# Altium schematic sheet DownLoad.SchDoc
size A4
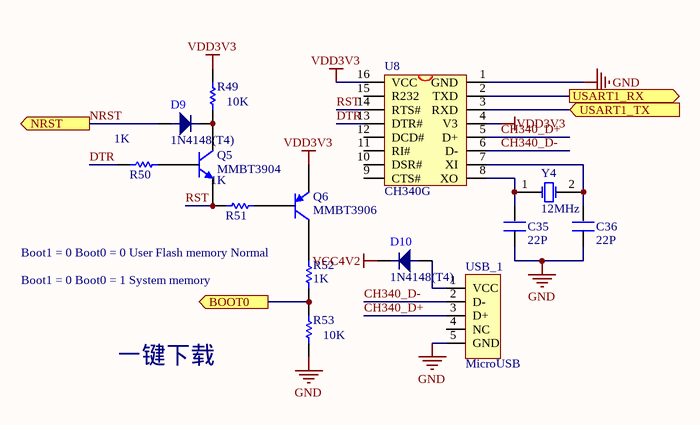
[diagram p0: DownLoad.SchDoc]

## Parts
C35  22P  [0805-CAP]
C36  22P  [0805-CAP]
D9  1N4148(T4)  [SOD-123]
D10  1N4148(T4)  [SOD-123]
Q5  MMBT3904  [SOT23_N]
Q6  MMBT3906  [SOT23_N]
R49  value 10K  [RESC0805(2012)_M]  (hidden comment: 10K 1% 0805(2012))
R50  value 1K  [RESC0805(2012)_M]  (hidden comment: 1K 1% 0805(2012))
R51  value 1K  [RESC0805(2012)_M]  (hidden comment: 1K 1% 0805(2012))
R52  value 1K  [RESC0805(2012)_M]  (hidden comment: 1K 1% 0805(2012))
R53  value 10K  [RESC0805(2012)_M]  (hidden comment: 10K 1% 0805(2012))
U8  CH340G  [SOP16M]
USB_1  MicroUSB  [USB_micro]
Y4  12MHz  [XTAL_US]

## Ports
BOOT0 (out), NRST (out), USART1_RX (out), USART1_TX (in)

## Nets
GND: C35.1 C36.1 R53.1 U8.1(GND) USB_1.5(GND)
VCC4V2: D10.2
VDD3V3: Q6.2(E) R49.2 U8.4(V3) U8.16(VCC)
BOOT0: R52.1 R53.2 ; port BOOT0
CH340_D+: U8.5(D+) USB_1.3(D+)
CH340_D-: U8.6(D-) USB_1.2(D-)
DTR: R50.1 U8.13(DTR#)
NRST: D9.1 ; port NRST
RST: Q5.2(E) R51.1 U8.14(RTS#)
USART1_RX: U8.2(TXD) ; port USART1_RX
USART1_TX: U8.3(RXD) ; port USART1_TX
NetC35_2: C35.2 U8.8(XO) Y4.1(OSC1)
NetC36_2: C36.2 U8.7(XI) Y4.2(OSC2)
NetD9_2: D9.2 Q5.3(C) R49.1
NetD10_1: D10.1 USB_1.1(VCC)
NetQ5_1: Q5.1(B) R50.2
NetQ6_1: Q6.1(B) R51.2
NetQ6_3: Q6.3(C) R52.2

Not connected (* = marked no-connect by the designer): U8 9(CTS#) 10(DSR#) 11(RI#) 12(DCD#) 15(R232); USB_1 4(NC)

## Notes on the sheet
- Boot1 = 0 Boot0 = 0 User Flash memory Normal
- Boot1 = 0 Boot0 = 1 System memory
- 一键下载

## Library data of the parts
C35 C36 = C
D9 D10 = 1N4148: 高速开关二极管
Q5 = MMBT3904: NPN Switching Transistor; Published: 17-Sep-2003; LatestRevisionDate: 12-Dec-2006; LatestRevisionNote: IPC-7351 Footprint Added.; DatasheetVersion: 13-May-2002; PackageVersion: May-1999; PackageReference: SOT23; Publisher: Altium Limited; PackageDescription: 3-Pin SOT-23 Package 0.95 mm Pitch, 2.3 mm Lead Span; ComponentLink1Description: Manufacturer Link; ComponentLink1URL: http://www.semiconductors.philips.com/; ComponentLink2Description: Datasheet; ComponentLink2URL: http://www.semiconductors.philips.com/acrobat/datasheets/MMBT3904_4.pdf
Q6 = MMBT3906: PNP Switching Transistor; Published: 17-Sep-2003; LatestRevisionDate: 12-Dec-2006; LatestRevisionNote: IPC-7351 Footprint Added.; DatasheetVersion: 11-Apr-2000; PackageVersion: May-1999; PackageReference: SOT23; Publisher: Altium Limited; PackageDescription: 3-Pin SOT-23 Package 0.95 mm Pitch, 2.3 mm Lead Span; ComponentLink1Description: Manufacturer Link; ComponentLink1URL: http://www.semiconductors.philips.com/; ComponentLink2Description: Datasheet; ComponentLink2URL: http://www.semiconductors.philips.com/acrobat/datasheets/MMBT3906_2.pdf
R49 R53 = CMP-1013-00623-1: 10K 0.125W 1% 0805 (2012 Metric)  SMD; Case-Metric: 2012; Case-EIA: 0805; Tolerance: 1 %; Power: 0.125 W; Technology: SMT
R50-R52 = CMP-1013-00510-1: 1K 0.125W 1% 0805 (2012 Metric)  SMD; Case-Metric: 2012; Case-EIA: 0805; Tolerance: 1 %; Power: 0.125 W; Technology: SMT
U8 = CH340G: USB2UART
USB_1 = USB5
Y4 = XTAL: Crystal Oscillator; Published: 8-Jun-2000; LatestRevisionDate: 17-Jul-2002; LatestRevisionNote: Re-released for DXP Platform.; Publisher: Altium Limited